# EAGLE schematic tft (EAGLE 9.6.2)
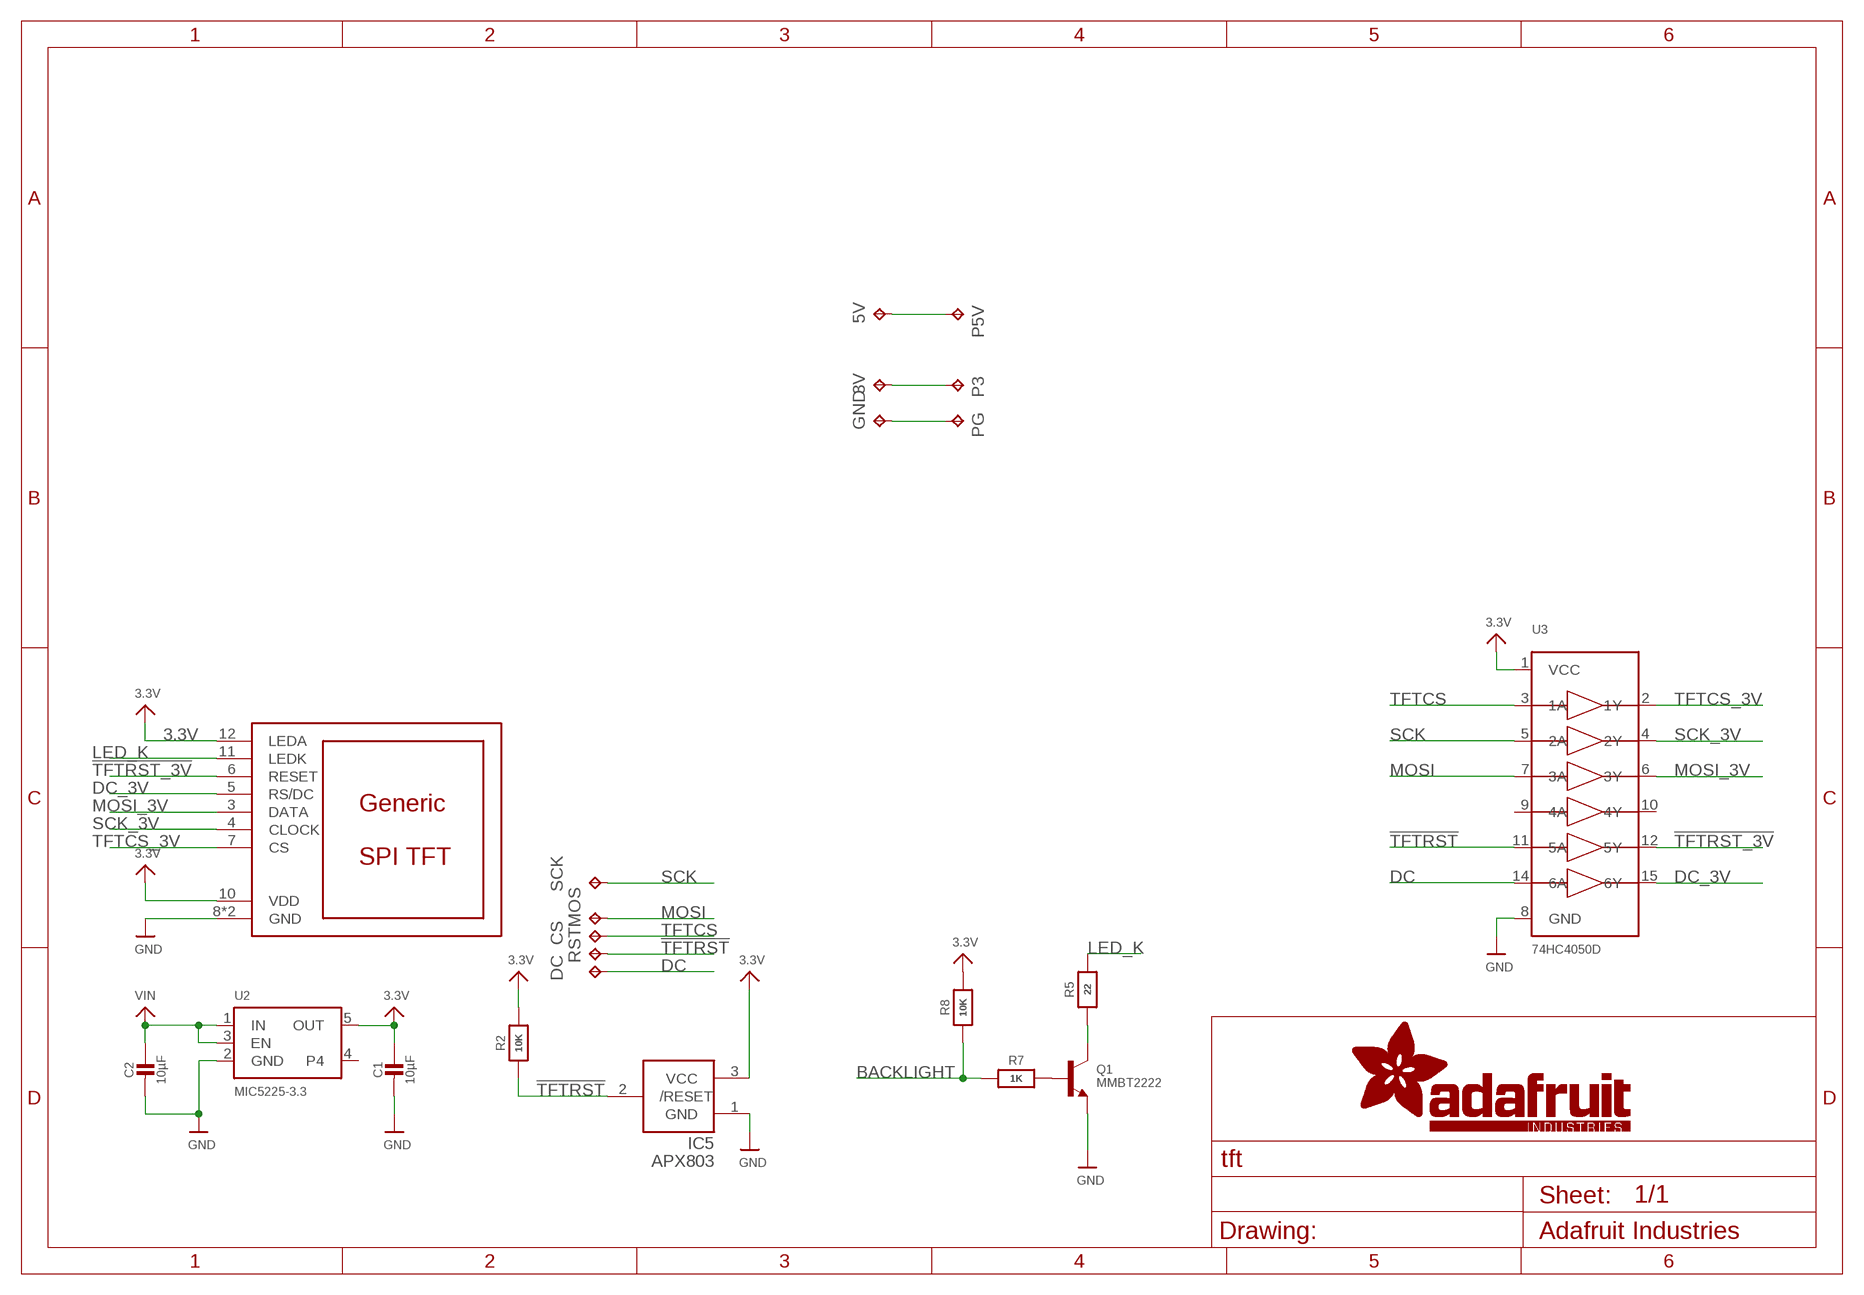
[diagram p0: schematic, sheet 1]

## Parts
3V  TPB1,27  [B1,27]
5V  TPB1,27  [B1,27]
C1  10µF  CAP_CERAMIC0805-NOOUTLINE  [0805-NO]
C2  10µF  CAP_CERAMIC0805-NOOUTLINE  [0805-NO]
CS  TPB1,27  [B1,27]
DC  TPB1,27  [B1,27]
DISP1  DISP_LCD_GENERIC_SPI_1.14IN_240X135_WRAPUNDER  [TFT_1.14IN_240X135_WRAPUNDER]
GND  TPB1,27  [B1,27]
IC5  APX803  AXP083-SAG  [SOT23]
MOS  TPB1,27  [B1,27]
P3  TPB1,27  [B1,27]
P5V  TPB1,27  [B1,27]
PG  TPB1,27  [B1,27]
Q1  MMBT2222  TRANSISTOR_NPNWIDE  [SOT23-WIDE]
R2  10K  RESISTOR_0603_NOOUT  [0603-NO]
R5  22  RESISTOR_0603_NOOUT  [0603-NO]
R7  1K  RESISTOR_0603_NOOUT  [0603-NO]
R8  10K  RESISTOR_0603_NOOUT  [0603-NO]
RST  TPB1,27  [B1,27]
SCK  TPB1,27  [B1,27]
U2  MIC5225-3.3  VREG_SOT23-5  [SOT23-5]
U3  74HC4050D  [SOIC16]

## Nets
3.3V: C1.1 DISP1.10(VDD) DISP1.12(LEDA) IC5.3(VCC) R2.2 R8.2 U2.5(OUT) U3.1(VCC)
!TFTRST: IC5.2(/RESET) R2.1 RST.TP U3.11(5A)
!TFTRST_3V: DISP1.6(RESET) U3.12(5Y)
BACKLIGHT: R7.1 R8.1
DC: DC.TP U3.14(6A)
DC_3V: DISP1.5(RS/DC) U3.15(6Y)
GND: C1.2 C2.2 DISP1.8(GND) DISP1.13(GND) GND.TP IC5.1(GND) PG.TP Q1.2(E) U2.2(GND) U3.8(GND)
LED_K: DISP1.11(LEDK) R5.2
MOSI: MOS.TP U3.7(3A)
MOSI_3V: DISP1.3(DATA) U3.6(3Y)
N$1: Q1.1(B) R7.2
N$2: 5V.TP P5V.TP
N$5: Q1.3(C) R5.1
SCK: SCK.TP U3.5(2A)
SCK_3V: DISP1.4(CLOCK) U3.4(2Y)
TFTCS: CS.TP U3.3(1A)
TFTCS_3V: DISP1.7(CS) U3.2(1Y)
VIN: 3V.TP C2.1 P3.TP U2.1(IN) U2.3(EN)
Unconnected: U2.4 U3.9(4A) U3.10(4Y)

## Library data of the parts
3V 5V CS DC GND MOS P3 P5V PG RST SCK = testpad:TP: Test pad
C1 C2 = microbuilder:CAP_CERAMIC: Ceramic Capacitors For new designs, use the packages preceded by an '_' character since they are more reliable: The following footprints should be used on most boards: _0402 - Standard footprint for regular board layouts _0603 - Standard footprint for regular board layouts _0805 - Standard footprint for regular board layouts _1206 - Standard footprint for regular board layouts For extremely tight-pitch boards where space is at a premium, the following 'micro-pitch' footprints can be used (smaller pads, no silkscreen outline, etc.): _0402MP - Micro-pitch footprint for very dense/compact boards _0603MP - Micro-pitch footprint for very dense/compact boards _0805MP - Micro-pitch footprint for very dense/compact boards _1206MP - Micro-pitch footprint for very dense/compact boards
DISP1 = microbuilder:DISP_LCD_GENERIC_SPI
IC5 = adafruit:AXP083
Q1 = microbuilder:TRANSISTOR_NPN: NPN Transistor Transistor (NPN) 500mA 45V - BC817 [Digikey: 568-1631-1-ND] Transistor (NPN) 500mA 45V - BC817,215 [Mouser: 771-BC817-T/R] SOT23-R - SOT23 footprint optimised for use with solder paste and reflow ovens. SOT23-W - SOT23 footprint optimised for hand-soldering (larger pads).
R2 R5 R7 R8 = microbuilder:RESISTOR: Resistors For new designs, use the packages preceded by an '_' character since they are more reliable: The following footprints should be used on most boards: _0402 - Standard footprint for regular board layouts _0603 - Standard footprint for regular board layouts _0805 - Standard footprint for regular board layouts _1206 - Standard footprint for regular board layouts For extremely tight-pitch boards where space is at a premium, the following 'micro-pitch' footprints can be used (smaller pads, no silkscreen outline, etc.): _0402MP - Micro-pitch footprint for very dense/compact boards _0603MP - Micro-pitch footprint for very dense/compact boards _0805MP - Micro-pitch footprint for very dense/compact boards _1206MP - Micro-pitch footprint for very dense/compact boards
U2 = microbuilder:VREG_SOT23-5: SOT23-5 Fixed Voltage Regulators Part Current Out V Out V In V Dropout θJA (°C/W) TJ (°C) Digikey Part No. ADP121 150mA 3.3V 3.4-5.5V 0.09V @ 150mA -- -- ADP121-AUJZ33R7CT-ND ADP121 150mA 3.0V 3.1-5.5V 0.09V @ 150mA -- -- ADP121-AUJZ30R7CT-ND ADP122 300mA 3.3V 3.4-5.5V 0.085V @ 300mA -- -- ADP122AUJZ-3.3-R7CT-ND ADP1712 300mA 3.3V 3.5-5.5V 0.17V @ 300mA -- -- ADP1712AUJZ-3.3-R7TR-ND AP7311 (Low Cost) 150mA 3.3V 3.5-6V 0.15V @ 150mA -- -- AP7311-33WG-7DICT-ND LD39015M18R 150mA 1.8V 1.9V-5.5V 0.08V @ 100mA -- -- 497-6977-1-ND LP2985A-33DBVR 150mA 3.3V 3.3-16V 0.28V @ 150mA 206 150 296-18479-1-ND MCP1824T-3302E/OT 300mA 3.3V 3.5V-6V 0.2V @ 300mA -- -- MCP1824T-3302E/OTCT-ND MIC5205-2.5YM5 TR 150mA 2.5V 2.7-16V 0.165V @ 150mA -- -- 576-1257-2-ND MIC5205-3.0YM5 TR 150mA 3.0V 3.2V-16V 0.165V @ 150mA -- -- 576-1258-2-ND MIC5205-3.3YM5 TR 150mA 3.3V 3.5V-16V 0.165V @ 150mA -- -- 576-1259-2-ND TPS780330220 150mA 3.3V+2.2V 3.6-5.5V 250mV Max -- -- 296-23332-1-ND TDA3663/N1,135 100mA 3.3V 3.5-45V 0.18V @ 50mA -- -- 568-5343-1-ND Max operating temp can be calculated using θJA, TJ (max junction temperature), and power in watts. Set the "Maximum Ambient Temperature" until it reaches TJ ("Max Junction Temperature"), which is the absolute limit for safe use of the regulator: Heat Sink Temperature Calculator <http://www.daycounter.com/Calculators/Heat-Sink-Temperature-Calculator.phtml> For example, With 12V source into a 3.3V LP2985 and a 30mA load, we are dissipating (12V-3.3V) * 0.03A = 0.261W. With a θJA of 206 °C/W, a TJ of 150°C, and 261mW we can safely use the chip without a heat sink up to 75°C (=147.1°C Junction Temperature).
U3 = microbuilder:74HC4050D: 6-channel level shifter 74HC4050D - 2V-6V Supply SOIC16 Digikey: 74HC4050D,653-ND Mouser: 771-74HC4050D-T TSSOP16 Digikey: 296-9215-1-ND Mouser:

## Net classes
0 default: width 0.076 mm, clearance 0.076 mm